# Altium schematic sheet ver060_Overview.SchDoc
size A3; SheetNumber: 1; SheetTotal: 6
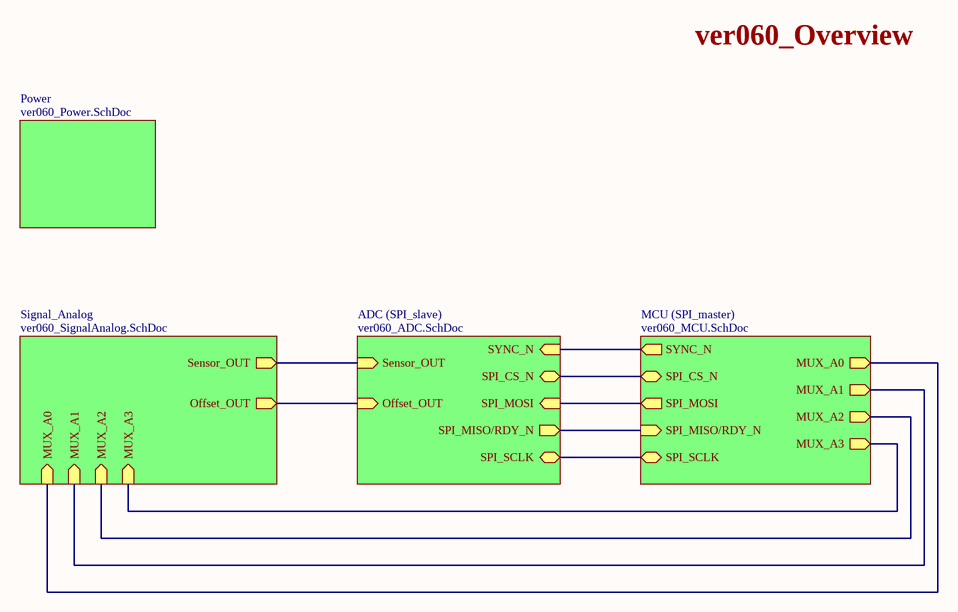
[diagram p0: ver060_Overview.SchDoc]

## Sub-sheets
ADC (SPI_slave) = ver060_ADC.SchDoc: SPI_CS_N (bidir), Sensor_OUT (in), SPI_MOSI (in), SPI_SCLK (bidir), SYNC_N (in), Offset_OUT (in), SPI_MISO/RDY_N (out)
MCU (SPI_master) = ver060_MCU.SchDoc: SPI_MOSI (out), SPI_MISO/RDY_N (in), SPI_SCLK (bidir), SPI_CS_N (bidir), MUX_A0 (out), SYNC_N (out), MUX_A3 (out), MUX_A1 (out), MUX_A2 (out)
Power = ver060_Power.SchDoc: no entries
Signal_Analog = ver060_SignalAnalog.SchDoc: Sensor_OUT (out), MUX_A1 (in), MUX_A0 (in), Offset_OUT (out), MUX_A3 (in), MUX_A2 (in)

## Nets
(unnamed): sheet Signal_Analog/Sensor_OUT, sheet ADC (SPI_slave)/Sensor_OUT
(unnamed): sheet Signal_Analog/MUX_A1, sheet MCU (SPI_master)/MUX_A1
(unnamed): sheet Signal_Analog/MUX_A0, sheet MCU (SPI_master)/MUX_A0
(unnamed): sheet Signal_Analog/Offset_OUT, sheet ADC (SPI_slave)/Offset_OUT
(unnamed): sheet Signal_Analog/MUX_A3, sheet MCU (SPI_master)/MUX_A3
(unnamed): sheet Signal_Analog/MUX_A2, sheet MCU (SPI_master)/MUX_A2
(unnamed): sheet ADC (SPI_slave)/SPI_CS_N, sheet MCU (SPI_master)/SPI_CS_N
(unnamed): sheet ADC (SPI_slave)/SPI_MOSI, sheet MCU (SPI_master)/SPI_MOSI
(unnamed): sheet ADC (SPI_slave)/SPI_SCLK, sheet MCU (SPI_master)/SPI_SCLK
(unnamed): sheet ADC (SPI_slave)/SYNC_N, sheet MCU (SPI_master)/SYNC_N
(unnamed): sheet ADC (SPI_slave)/SPI_MISO/RDY_N, sheet MCU (SPI_master)/SPI_MISO/RDY_N

## Notes on the sheet
- ver060_Overview